# EAGLE schematic 2020-08-18 Motor Board (EAGLE 8.6.3)
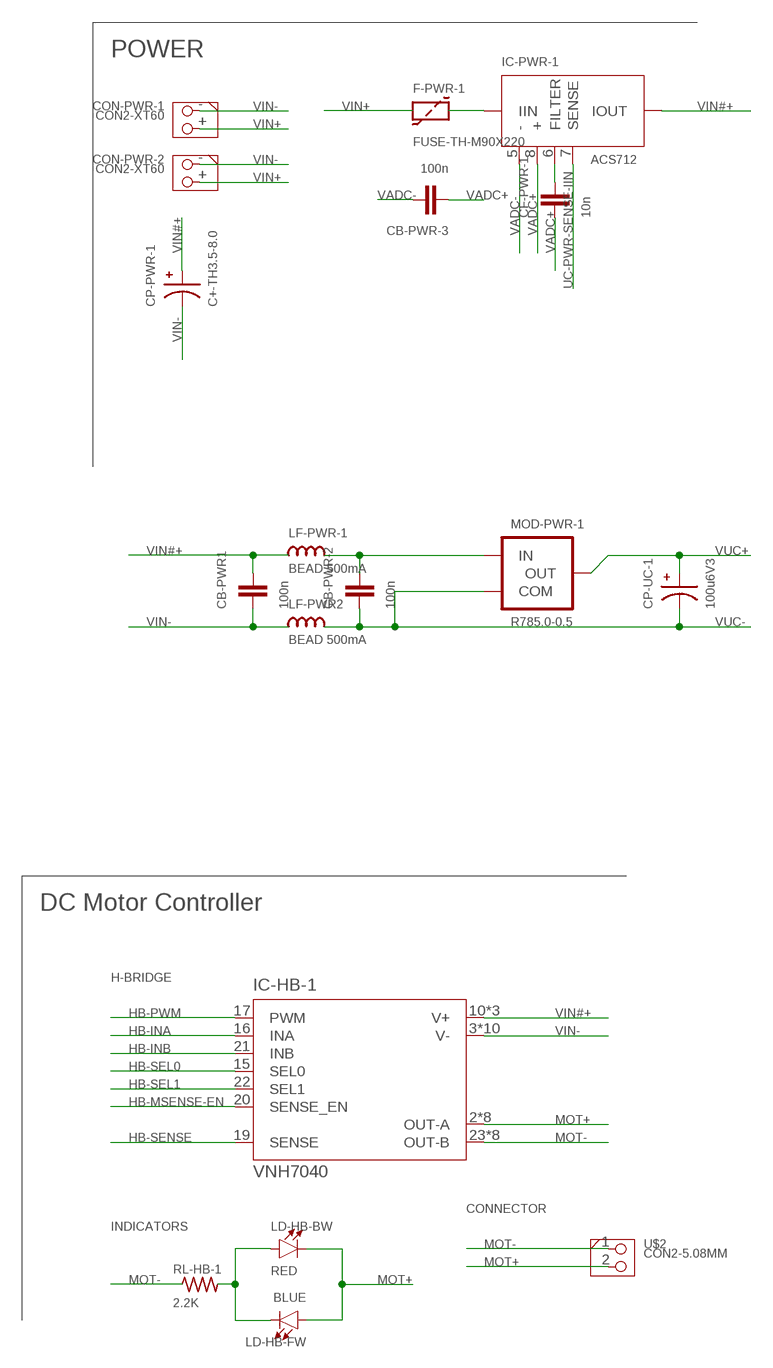
[diagram p0: schematic, sheet 1, part 1 of 2]
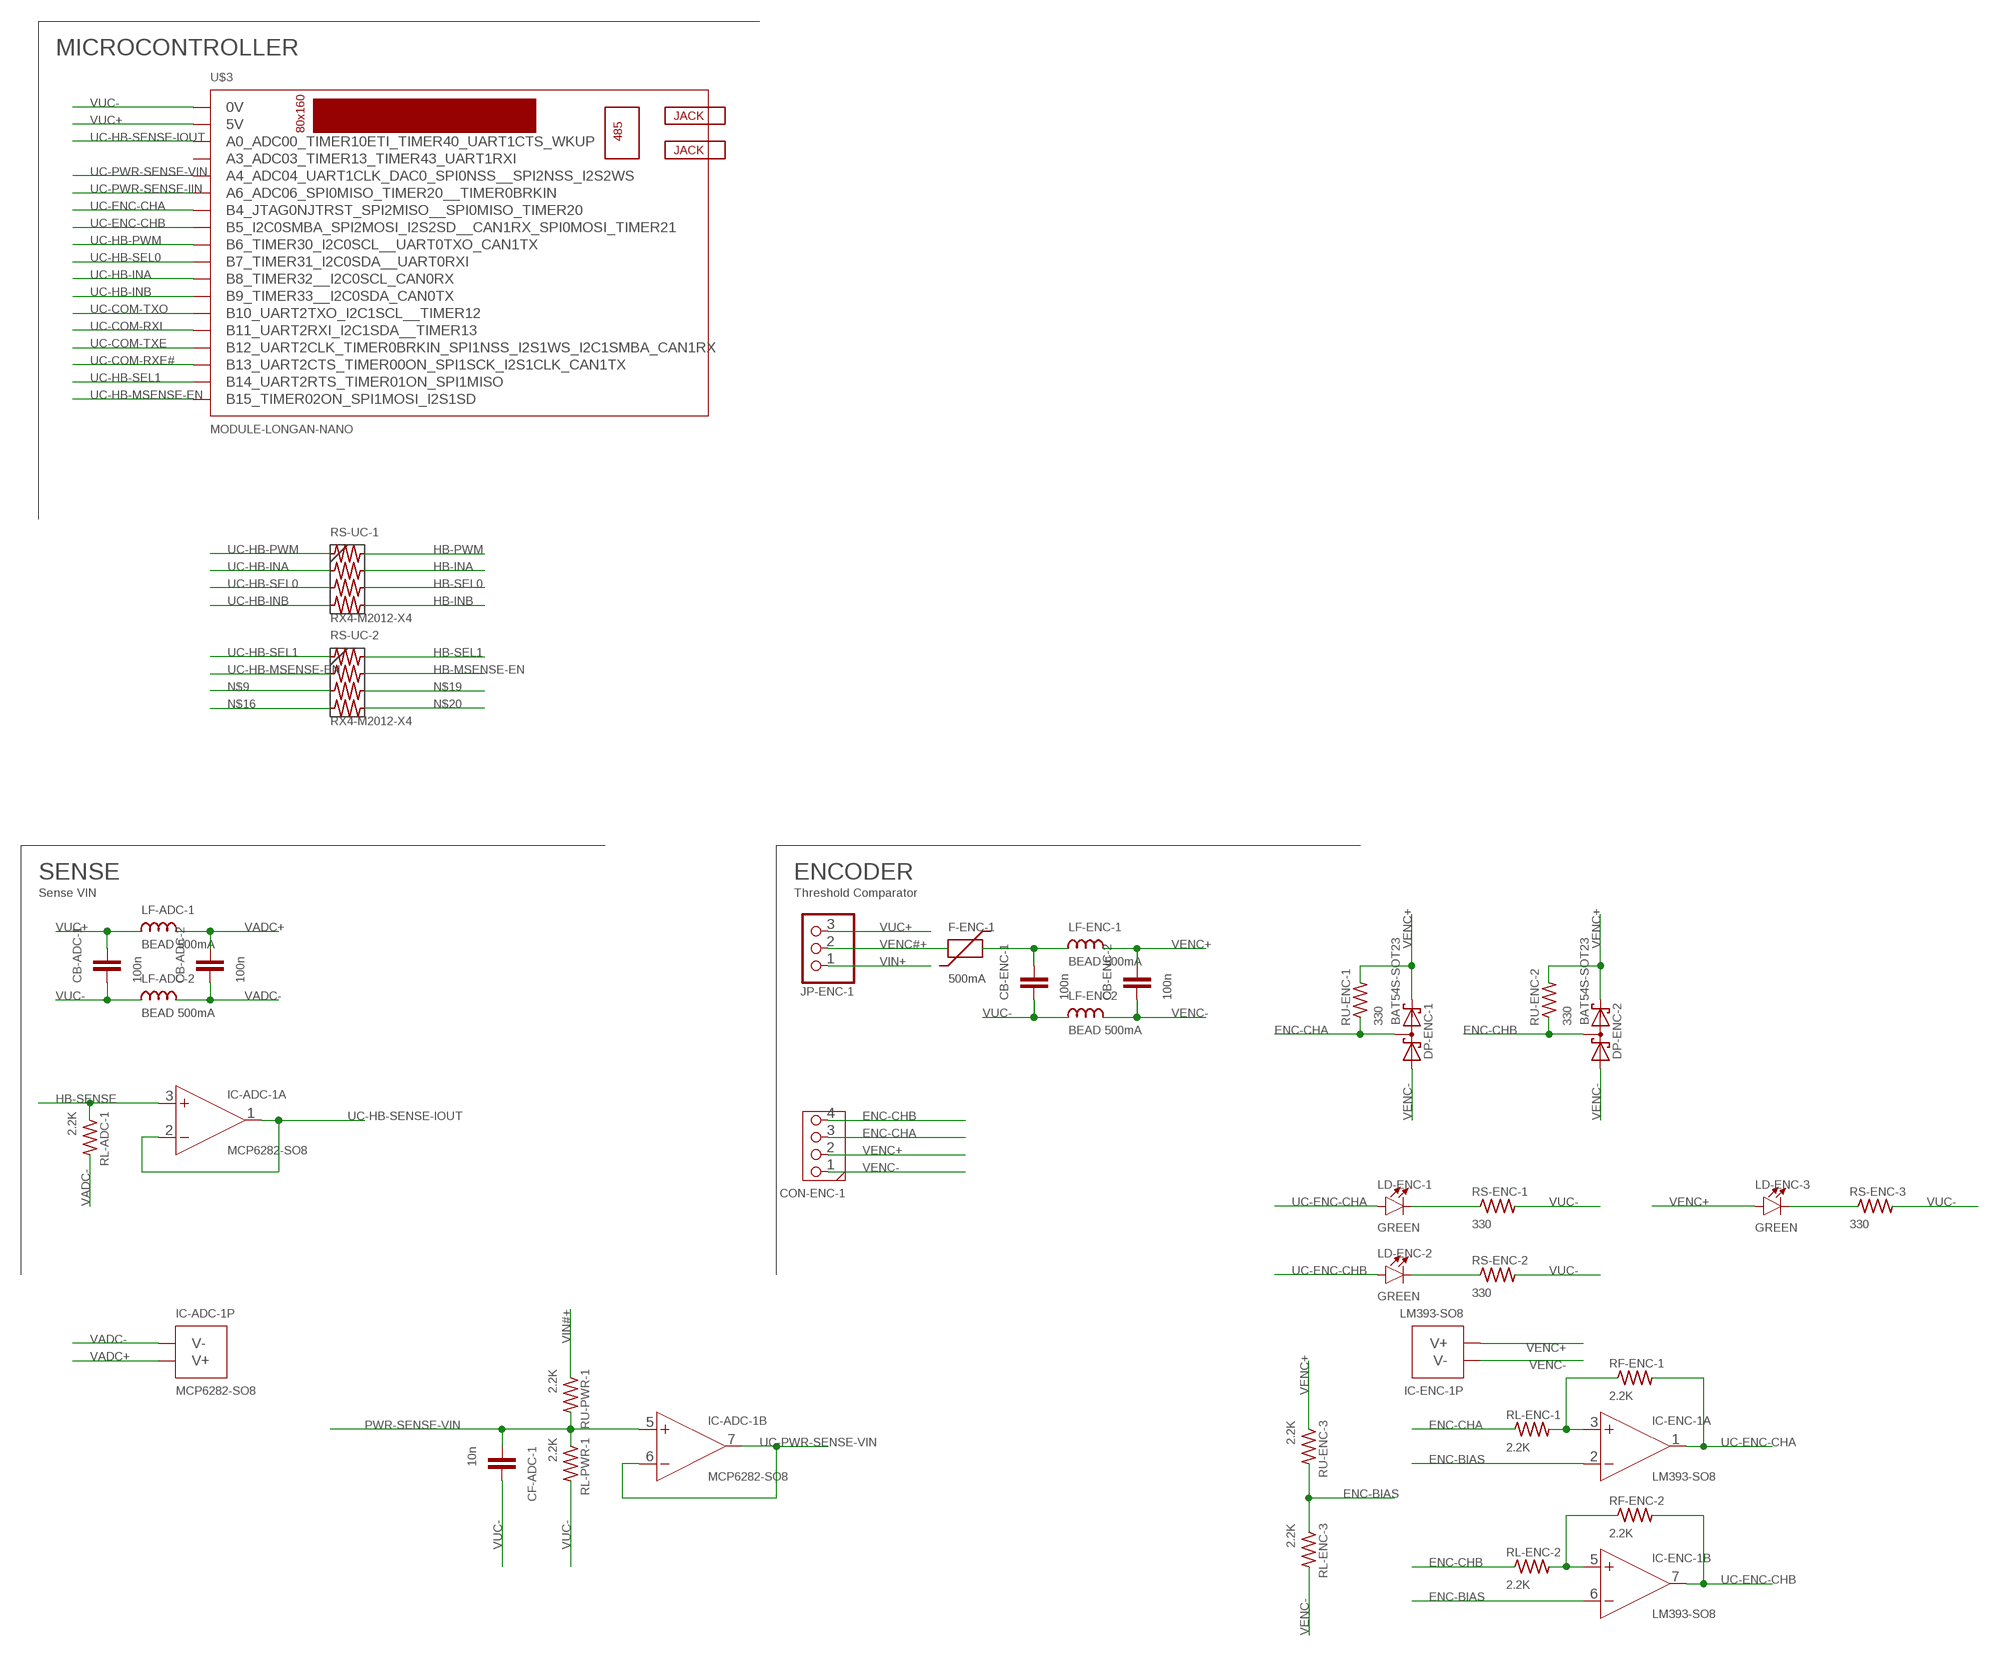
[diagram p1: schematic, sheet 1, part 2 of 2]

## Parts
CB-ADC-1  100n  C-M2012  [SMD-M2012]
CB-ADC-2  100n  C-M2012  [SMD-M2012]
CB-ENC-1  100n  C-M2012  [SMD-M2012]
CB-ENC-2  100n  C-M2012  [SMD-M2012]
CB-PWR1  100n  C-M2012  [SMD-M2012]
CB-PWR-2  100n  C-M2012  [SMD-M2012]
CB-PWR-3  100n  C-M2012  [SMD-M2012]
CF-ADC-1  10n  C-M2012  [SMD-M2012]
CF-PWR-1  10n  C-M2012  [SMD-M2012]
CON-ENC-1  CON4  [CON4]
CON-PWR-1  CON2-XT60  [AMASS_XT60-M]
CON-PWR-2  CON2-XT60  [AMASS_XT60-M]
CP-PWR-1  C+-TH3.5-8.0  [TH-BARREL-3M5-8M0]
CP-UC-1  100u6V3  C+-TH2.54-6.0  [TH-BARREL-2M54-6M0]
DP-ENC-1  BAT54S-SOT23  [SOT23]
DP-ENC-2  BAT54S-SOT23  [SOT23]
F-ENC-1  500mA  PTC-M2012  [SMD-M2012]
F-PWR-1  FUSE-TH-M90X220  [TH-BOX-MM9X22]
IC-ADC-1  MCP6282-SO8  [SO8]
IC-ENC-1  LM393-SO8  [SO8]
IC-HB-1  VNH7040  [SSO-36-TP]
IC-PWR-1  ACS712  [SO8]
JP-ENC-1  PINHD-1X3  [1X03]
LD-ENC-1  GREEN  LED-M2012  [SMD-M2012-POL]
LD-ENC-2  GREEN  LED-M2012  [SMD-M2012-POL]
LD-ENC-3  GREEN  LED-M2012  [SMD-M2012-POL]
LD-HB-BW  RED  LED-M2012  [SMD-M2012-POL]
LD-HB-FW  BLUE  LED-M2012  [SMD-M2012-POL]
LF-ADC-1  BEAD 500mA  L-M2012  [SMD-M2012]
LF-ADC-2  BEAD 500mA  L-M2012  [SMD-M2012]
LF-ENC2  BEAD 500mA  L-M2012  [SMD-M2012]
LF-ENC-1  BEAD 500mA  L-M2012  [SMD-M2012]
LF-PWR2  BEAD 500mA  L-M2012  [SMD-M2012]
LF-PWR-1  BEAD 500mA  L-M2012  [SMD-M2012]
MOD-PWR-1  R785.0-0.5  78XX  [CUSTOM_SIP3_PIN]
RF-ENC-1  2.2K  R-M2012  [SMD-M2012]
RF-ENC-2  2.2K  R-M2012  [SMD-M2012]
RL-ADC-1  2.2K  R-M2012  [SMD-M2012]
RL-ENC-1  2.2K  R-M2012  [SMD-M2012]
RL-ENC-2  2.2K  R-M2012  [SMD-M2012]
RL-ENC-3  2.2K  R-M2012  [SMD-M2012]
RL-HB-1  2.2K  R-M2012  [SMD-M2012]
RL-PWR-1  2.2K  R-M2012  [SMD-M2012]
RS-ENC-1  330  R-M2012  [SMD-M2012]
RS-ENC-2  330  R-M2012  [SMD-M2012]
RS-ENC-3  330  R-M2012  [SMD-M2012]
RS-UC-1  RX4-M2012-X4  [SMD-M2012-X4]
RS-UC-2  RX4-M2012-X4  [SMD-M2012-X4]
RU-ENC-1  330  R-M2012  [SMD-M2012]
RU-ENC-2  330  R-M2012  [SMD-M2012]
RU-ENC-3  2.2K  R-M2012  [SMD-M2012]
RU-PWR-1  2.2K  R-M2012  [SMD-M2012]
U$2  CON2-5.08MM  [CON2-508]
U$3  MODULE-LONGAN-NANO  [MODULE-LONGAN-NANO]

## Nets
ENC-BIAS [Supply]: IC-ENC-1.2(A:-IN) IC-ENC-1.6(B:-IN) RL-ENC-3.1 RU-ENC-3.2
ENC-CHA: CON-ENC-1.3 DP-ENC-1.3(C1A2) RL-ENC-1.1 RU-ENC-1.1
ENC-CHB: CON-ENC-1.4 DP-ENC-2.3(C1A2) RL-ENC-2.1 RU-ENC-2.1
HB-INA: IC-HB-1.16(INA) RS-UC-1.2B
HB-INB: IC-HB-1.21(INB) RS-UC-1.4B
HB-MSENSE-EN: IC-HB-1.20(SENSE_EN) RS-UC-2.2B
HB-PWM: IC-HB-1.17(PWM) RS-UC-1.1B
HB-SEL0: IC-HB-1.15(SEL0) RS-UC-1.3B
HB-SEL1: IC-HB-1.22(SEL1) RS-UC-2.1B
HB-SENSE: IC-ADC-1.3(A:+IN) IC-HB-1.19(SENSE) RL-ADC-1.1
MOT+: IC-HB-1.2(OUT-A) IC-HB-1.8(OUT-A) IC-HB-1.9(OUT-A) IC-HB-1.11(OUT-A) IC-HB-1.12(OUT-A) IC-HB-1.13(OUT-A) IC-HB-1.14(OUT-A) IC-HB-1.PAD2(OUT-A) LD-HB-BW.- LD-HB-FW.+ U$2.2
MOT-: IC-HB-1.23(OUT-B) IC-HB-1.24(OUT-B) IC-HB-1.25(OUT-B) IC-HB-1.26(OUT-B) IC-HB-1.28(OUT-B) IC-HB-1.29(OUT-B) IC-HB-1.35(OUT-B) IC-HB-1.PAD3(OUT-B) RL-HB-1.1 U$2.1
N$1: LD-HB-BW.+ LD-HB-FW.- RL-HB-1.2
N$2: CF-PWR-1.2 IC-PWR-1.6(FILTER)
N$3: F-PWR-1.2 IC-PWR-1.1(IIN) IC-PWR-1.2(IIN)
N$4 [Supply]: IC-ENC-1.3(A:+IN) RF-ENC-1.1 RL-ENC-1.2
N$5 [Supply]: LD-ENC-2.- RS-ENC-2.1
N$9: RS-UC-2.3A
N$11 [Supply]: IC-ENC-1.5(B:+IN) RF-ENC-2.1 RL-ENC-2.2
N$12 [Supply]: LD-ENC-1.- RS-ENC-1.1
N$13: CB-PWR-2.2 LF-PWR-1.2 MOD-PWR-1.VIN(IN)
N$14: CB-ENC-1.2 F-ENC-1.2 LF-ENC-1.1
N$15 [Supply]: LD-ENC-3.- RS-ENC-3.1
N$16: RS-UC-2.4A
N$19: RS-UC-2.3B
N$20: RS-UC-2.4B
PWR-SENSE-VIN: CF-ADC-1.1 IC-ADC-1.5(B:+IN) RL-PWR-1.1 RU-PWR-1.2
UC-COM-RXE#: U$3.B13(B13_UART2CTS_TIMER00ON_SPI1SCK_I2S1CLK_CAN1TX)
UC-COM-RXI: U$3.B11(B11_UART2RXI_I2C1SDA__TIMER13)
UC-COM-TXE: U$3.B12(B12_UART2CLK_TIMER0BRKIN_SPI1NSS_I2S1WS_I2C1SMBA_CAN1RX)
UC-COM-TXO: U$3.B10(B10_UART2TXO_I2C1SCL__TIMER12)
UC-ENC-CHA: IC-ENC-1.1(A:OUT) LD-ENC-1.+ RF-ENC-1.2 U$3.B4(B4_JTAG0NJTRST_SPI2MISO__SPI0MISO_TIMER20)
UC-ENC-CHB: IC-ENC-1.7(B:OUT) LD-ENC-2.+ RF-ENC-2.2 U$3.B5(B5_I2C0SMBA_SPI2MOSI_I2S2SD__CAN1RX_SPI0MOSI_TIMER21)
UC-HB-INA: RS-UC-1.2A U$3.B8(B8_TIMER32__I2C0SCL_CAN0RX)
UC-HB-INB: RS-UC-1.4A U$3.B9(B9_TIMER33__I2C0SDA_CAN0TX)
UC-HB-MSENSE-EN: RS-UC-2.2A U$3.B15(B15_TIMER02ON_SPI1MOSI_I2S1SD)
UC-HB-PWM: RS-UC-1.1A U$3.B6(B6_TIMER30_I2C0SCL__UART0TXO_CAN1TX)
UC-HB-SEL0: RS-UC-1.3A U$3.B7(B7_TIMER31_I2C0SDA__UART0RXI)
UC-HB-SEL1: RS-UC-2.1A U$3.B14(B14_UART2RTS_TIMER01ON_SPI1MISO)
UC-HB-SENSE-IOUT: IC-ADC-1.1(A:OUT) IC-ADC-1.2(A:-IN) U$3.A0(A0_ADC00_TIMER10ETI_TIMER40_UART1CTS_WKUP)
UC-PWR-SENSE-IIN: IC-PWR-1.7(SENSE) U$3.A6(A6_ADC06_SPI0MISO_TIMER20__TIMER0BRKIN)
UC-PWR-SENSE-VIN: IC-ADC-1.6(B:-IN) IC-ADC-1.7(B:OUT) U$3.A4(A4_ADC04_UART1CLK_DAC0_SPI0NSS__SPI2NSS_I2S2WS)
VADC+ [Supply]: CB-ADC-2.2 CB-PWR-3.1 CF-PWR-1.1 IC-ADC-1.8(P:V+) IC-PWR-1.8(+) LF-ADC-1.2
VADC-: CB-ADC-2.1 CB-PWR-3.2 IC-ADC-1.4(P:V-) IC-PWR-1.5(-) LF-ADC-2.2 RL-ADC-1.2
VENC#+: F-ENC-1.1 JP-ENC-1.2
VENC+: CB-ENC-2.2 CON-ENC-1.2 DP-ENC-1.2(C2) DP-ENC-2.2(C2) IC-ENC-1.8(P:V+) LD-ENC-3.+ LF-ENC-1.2 RU-ENC-1.2 RU-ENC-2.2 RU-ENC-3.1
VENC-: CB-ENC-2.1 CON-ENC-1.1 DP-ENC-1.1(A1) DP-ENC-2.1(A1) IC-ENC-1.4(P:V-) LF-ENC2.2 RL-ENC-3.2
VIN#+: CB-PWR1.2 CP-PWR-1.+ IC-HB-1.10(V+) IC-HB-1.27(V+) IC-HB-1.PAD1(V+) IC-PWR-1.3(IOUT) IC-PWR-1.4(IOUT) LF-PWR-1.1 RU-PWR-1.1
VIN+: CON-PWR-1.+ CON-PWR-2.+ F-PWR-1.1 JP-ENC-1.1
VIN-: CB-PWR1.1 CON-PWR-1.- CON-PWR-2.- CP-PWR-1.- IC-HB-1.3(V-) IC-HB-1.4(V-) IC-HB-1.5(V-) IC-HB-1.6(V-) IC-HB-1.7(V-) IC-HB-1.30(V-) IC-HB-1.31(V-) IC-HB-1.32(V-) IC-HB-1.33(V-) IC-HB-1.34(V-) LF-PWR2.1
VUC+ [Supply]: CB-ADC-1.2 CP-UC-1.+ JP-ENC-1.3 LF-ADC-1.1 MOD-PWR-1.OUT U$3.5V
VUC- [Supply]: CB-ADC-1.1 CB-ENC-1.1 CB-PWR-2.1 CF-ADC-1.2 CP-UC-1.- LF-ADC-2.1 LF-ENC2.1 LF-PWR2.2 MOD-PWR-1.COM RL-PWR-1.2 RS-ENC-1.2 RS-ENC-2.2 RS-ENC-3.2 U$3.0V
Unconnected: U$3.A3(A3_ADC03_TIMER13_TIMER43_UART1RXI)

## Notes on the sheet
- POWER | MICROCONTROLLER
- DC Motor Controller | SENSE | ENCODER
- Sense VIN | Threshold Comparator
- H-BRIDGE
- CONNECTOR
- INDICATORS

## Library data of the parts
CB-ADC-1 CB-ADC-2 CB-ENC-1 CB-ENC-2 CB-PWR1 CB-PWR-2 CB-PWR-3 CF-ADC-1 CF-PWR-1 = Passives:C: Capacitor Standard Capacitor (non polarized)
CON-ENC-1 = 2020-08-18 Motor Board:CON4: PIN HEADER
CON-PWR-1 CON-PWR-2 U$2 = 2020-08-18 Motor Board:CON2: 2 pin screw connector
CP-PWR-1 CP-UC-1 = Passives:C+: Polarized Capacitor
DP-ENC-1 DP-ENC-2 = 2020-08-18 Motor Board:BAT54S: Schottky Diodes Pin connection corrected 2011-05-04 Source: Fairchild .. BAT54.pdf
F-ENC-1 = Passives:PTC
F-PWR-1 = 2020-08-18 Motor Board:FUSE: Fuse
IC-ADC-1 = 2020-08-18 Motor Board:MCP6282: Op Amp Rail to Rail
IC-ENC-1 = 2020-08-18 Motor Board:LM393: COMPARATOR
IC-HB-1 = 2020-08-18 Motor Board:VNH7040: VNH7040
IC-PWR-1 = 2020-08-18 Motor Board:ACS712: ACS712-{X} Hall effect current sensor {X} = current rating
JP-ENC-1 = 2020-08-18 Motor Board:PINHD-1X3: PIN HEADER
LD-ENC-1-LD-ENC-3 LD-HB-BW LD-HB-FW = Passives:LED: LED
LF-ADC-1 LF-ADC-2 LF-ENC2 LF-ENC-1 LF-PWR2 LF-PWR-1 = Passives:L: Inductor
MOD-PWR-1 = 2020-08-18 Motor Board:78XX: VOLTAGE REGULATOR
RF-ENC-1 RF-ENC-2 RL-ADC-1 RL-ENC-1-RL-ENC-3 RL-HB-1 RL-PWR-1 RS-ENC-1-RS-ENC-3 RU-ENC-1-RU-ENC-3 RU-PWR-1 = Passives:R: Resistor Standard Resistor
RS-UC-1 RS-UC-2 = Passives:RX4: Four Resistor
U$3 = 2020-08-18 Motor Board:MODULE-LONGAN-NANO: Longan Nano 485 Allows vertical mounting for the Longan Nano and adds 485 transceiver and 3.5mm audio jacks.

## Net classes
0 Signal: width 0.15 mm, drill 0.35 mm, clearance 0.15 mm
1 Supply: width 0.3 mm, drill 0.35 mm, clearance 0.2 mm
2 Power: width 0.5 mm, drill 0.5 mm, clearance 0.3 mm